# Altium schematic sheet POWER_SUPPLY_PAIRED.SchDoc
size A; SheetNumber: 1; SheetTotal: 1
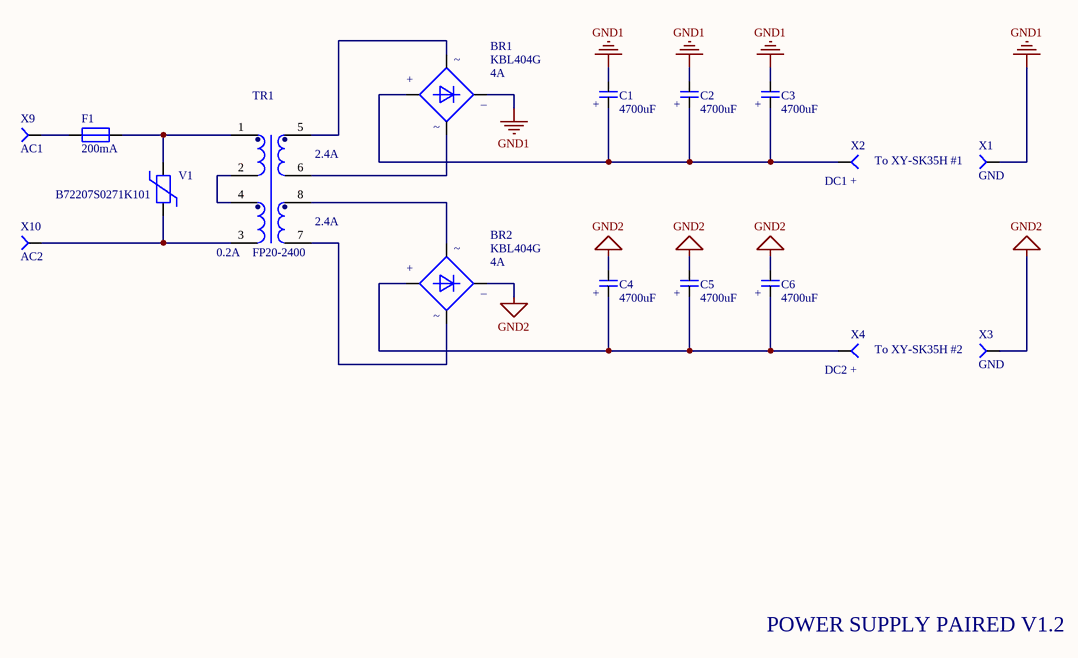
[diagram p0: POWER_SUPPLY_PAIRED.SchDoc]

## Parts
BR1  KBL404G  [THT_BRIGDE_KBL404G]
BR2  KBL404G  [THT_BRIGDE_KBL404G]
C1  4700uF  [THT_CAP_EL_SAMXON_EKM478M1HL40RRSAP]
C2  4700uF  [THT_CAP_EL_SAMXON_EKM478M1HL40RRSAP]
C3  4700uF  [THT_CAP_EL_SAMXON_EKM478M1HL40RRSAP]
C4  4700uF  [THT_CAP_EL_SAMXON_EKM478M1HL40RRSAP]
C5  4700uF  [THT_CAP_EL_SAMXON_EKM478M1HL40RRSAP]
C6  4700uF  [THT_CAP_EL_SAMXON_EKM478M1HL40RRSAP]
F1  200mA  [THT_FUSE-MICRO_MTS0200A]
TR1  FP20-2400  [THT_TRFMR_FP20-2400_TRIADMAG]
V1  B72207S0271K101  [THT_VAR_B72207S0271K101]
X1  GND  [THT_TERMINAL-PCB_L-KLS8-01128-PC-250]
X2  DC1 +  [THT_TERMINAL-PCB_L-KLS8-01128-PC-250]
X3  GND  [THT_TERMINAL-PCB_L-KLS8-01128-PC-250]
X4  DC2 +  [THT_TERMINAL-PCB_L-KLS8-01128-PC-250]
X9  AC1  [THT_TERMINAL-PCB_L-KLS8-01128-PC-250]
X10  AC2  [THT_TERMINAL-PCB_L-KLS8-01128-PC-250]

## Nets
GND1: BR1.4(-) C1.2 C2.2 C3.2 X1.1
GND2: BR2.4(-) C4.2 C5.2 C6.2 X3.1
NetBR1_1: BR1.1(+) C1.1 C2.1 C3.1 X2.1
NetBR1_2: BR1.2 TR1.5
NetBR1_3: BR1.3 TR1.6
NetBR2_1: BR2.1(+) C4.1 C5.1 C6.1 X4.1
NetBR2_2: BR2.2 TR1.8
NetBR2_3: BR2.3 TR1.7
NetF1_1: F1.1 X9.1
NetF1_2: F1.2 TR1.1 V1.2
NetTR1_2: TR1.2 TR1.4
NetTR1_3: TR1.3 V1.1 X10.1

## Notes on the sheet
- (near BR1) 4A
- (near TR1) 2.4A
- To XY-SK35H #1
- (near TR1) 0.2A
- (near BR2) 4A
- To XY-SK35H #2
- POWER SUPPLY PAIRED V1.2
- (in symbol THT_BRIGDE_KBL404G) _
- (in symbol THT_CAP_EL_SAMXON_EKM478M1HL40RRSAP) +
- (in symbol THT_TRFMR_FP20-2400_TRIADMAG) .

## Library data of the parts
BR1 BR2 = THT_BRIGDE_KBL404G: THT Diode Bridge 400V 4A KBL404G TAIWAN SEMICONDUCTOR
C1-C6 = THT_CAP_EL_SAMXON_EKM478M1HL40RRSAP: THT Capacitor Electrolytic 50V 4700uF Pitch 7.5mm SAMXON EKM478M1HL40RRSAP
F1 = THT_FUSE-MICRO_MTS0200A: THT Fuse Slow Blow Micro Fuse, 250V/200mA REOMAX
TR1 = THT_TRFMR_FP20-2400_TRIADMAG: THT Power Transformer 48VA Secondary=2.4A  Primary=230 VAC Secondary=20V FP20-2400 TRIAD MAGNETICS
V1 = THT_VAR_B72207S0271K101: THT Varistor 275V 1200A B72207S0271K101 EPCOS(TDK)
X1-X4 X9 X10 = THT_TERMINAL-PCB_L-KLS8-01128-PC-250: THT Terminal Tab PCB L-KLS8-01128-PC-250 KLS ELECTRONIC